# Altium project oled.PrjPCB
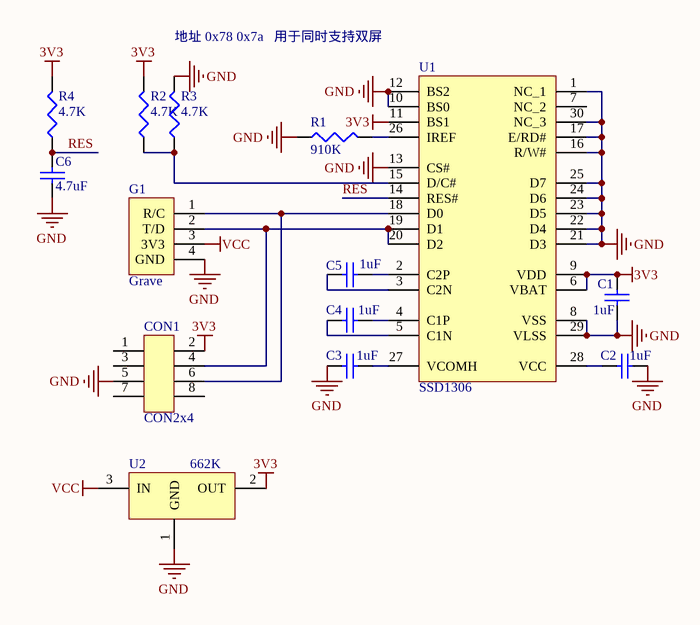
[diagram p0: oled.SchDoc]
1 sheet, 14 parts. Net scope: global (net labels, ports and power ports of the same name join across sheets).
Board file: oled.PcbDoc

## Sheet oled.SchDoc
size A4

### Parts
C1  value 1uF  [0603_C]
C2  value 1uF  [0603_C]
C3  value 1uF  [0603_C]
C4  value 1uF  [0603_C]
C5  value 1uF  [0603_C]
C6  value 4.7uF  [0603_C]
CON1  CON2x4  [2x4P_SMT_2.54mm]
G1  Grave  [S4B-PH-SM4]
R1  910K  [0603_R]
R2  4.7K  [0603_R]
R3  4.7K  [0603_R]
R4  4.7K  [0603_R]
U1  SSD1306  [OLED-0.96-30]
U2  662K  [SOT23-3]

### Nets
3V3: C1.2 CON1.2 R2.2 R4.2 U1.6(VBAT) U1.9(VDD) U1.11(BS1) U2.2(OUT)
GND: C1.1 C2.2 C3.1 C6.1 CON1.5 G1.4(GND) R1.1 R3.2 U1.1(NC_1) U1.8(VSS) U1.10(BS0) U1.12(BS2) U1.13(CS#) U1.16(R/W#) U1.17(E/RD#) U1.21(D3) U1.22(D4) U1.23(D5) U1.24(D6) U1.25(D7) U1.29(VLSS) U1.30(NC_3) U2.1(GND)
VCC: G1.3(3V3) U2.3(IN)
RES: C6.2 R4.1 U1.14(RES#)
NetC2_1: C2.1 U1.28(VCC)
NetC3_2: C3.2 U1.27(VCOMH)
NetC4_1: C4.1 U1.5(C1N)
NetC4_2: C4.2 U1.4(C1P)
NetC5_1: C5.1 U1.3(C2N)
NetC5_2: C5.2 U1.2(C2P)
NetCON1_4: CON1.4 G1.2(T/D) U1.19(D1) U1.20(D2)
NetCON1_6: CON1.6 G1.1(R/C) U1.18(D0)
NetR1_2: R1.2 U1.26(IREF)
NetR2_1: R2.1 R3.1 U1.15(D/C#)

Not connected (* = marked no-connect by the designer): CON1 1 3 7 8; U1 7(NC_2)

### Notes on the sheet
- 地址 0x78 0x7a   用于同时支持双屏

### Library data of the parts
C1-C6 = Cap: Published: 8-Jun-2000; LatestRevisionDate: 29-May-2009; LatestRevisionNote: IPC-7351 Footprint Added.; PackageReference: C1206; Publisher: Altium Limited; PackageDescription: Chip Capacitor
G1 = Grove
R1-R4 = Res: Published: 8-Jun-2000; LatestRevisionDate: 29-May-2009; LatestRevisionNote: IPC-7351 Footprint Added.; PackageReference: J1-0603; Publisher: Altium Limited; PackageDescription: Chip Resistor
U2 = 662K: 或 S-1206B30-M3